# EAGLE design bASEpLATE (EAGLE 8.2.2)
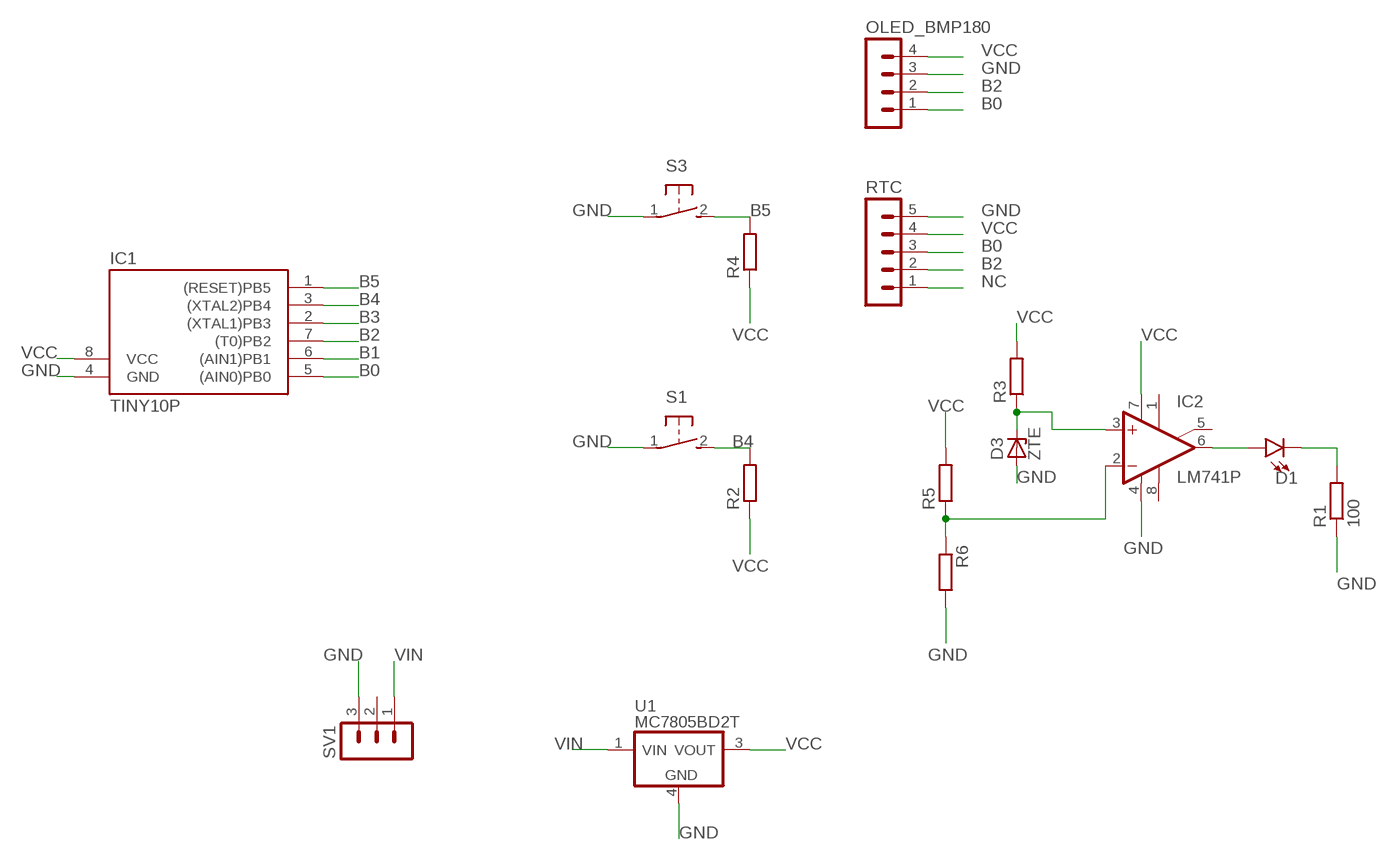
[diagram p0: schematic, sheet 1]

## Parts
D1  LED-3MM-NO_SILK  [LED_3MM-NS]
D3  ZTE  [DO35Z10]
IC1  TINY10P  [DIL08]
IC2  LM741P  [DIL08]
OLED_BMP180  MA04-1  [MA04-1]
R1  100  R-EU_0204/7  [0204/7]
R2  R-EU_0204/7  [0204/7]
R3  R-EU_0204/7  [0204/7]
R4  R-EU_0204/7  [0204/7]
R5  R-EU_0204/7  [0204/7]
R6  R-EU_0204/7  [0204/7]
RTC  MA05-1  [MA05-1]
S1  31-XX  [B3F-31XX]
S3  31-XX  [B3F-31XX]
SV1  MA03-1  [MA03-1]
U1  MC7805BD2T  [D2PAK-3]

## Nets
B0: IC1.5((AIN0)PB0) OLED_BMP180.1 RTC.3
B1: IC1.6((AIN1)PB1)
B2: IC1.7((T0)PB2) OLED_BMP180.2 RTC.2
B3: IC1.2((XTAL1)PB3)
B4: IC1.3((XTAL2)PB4) R2.2 S1.2(S)
B5: IC1.1((RESET)PB5) R4.2 S3.2(S)
GND: D3.A IC1.4(GND) IC2.4(V-) OLED_BMP180.3 R1.1 R6.2 RTC.5 S1.1(P) S3.1(P) SV1.3 U1.4(GND)
N$1: D1.A IC2.6(OUT)
N$2: IC2.2(-IN) R5.1 R6.1
N$3: D3.C IC2.3(+IN) R3.1
N$4: D1.K(C) R1.2
NC: RTC.1
VCC: IC1.8(VCC) IC2.7(V+) OLED_BMP180.4 R2.1 R3.2 R4.1 R5.2 RTC.4 U1.3(VOUT)
VIN: SV1.1 U1.1(VIN)
Unconnected: IC2.1(ON1) IC2.5(ON2) IC2.8(OPT) SV1.2

## Library data of the parts
D1 = SparkFun-LED:LED: LED (Generic) Standard schematic elements and footprints for 5mm, 3mm, 1206, and 0603 sized LEDs. Generic LEDs with no color specified.
D3 = diode:ZTE: Z DIODE 300 mW
IC1 = atmel:TINY10: MICROCONTROLLER 1 Kbytes ROM; OC_FARNELL: unknown; OC_NEWARK: unknown
IC2 = linear:*741: OP AMP
OLED_BMP180 = con-lstb:MA04-1: PIN HEADER; OC_FARNELL: unknown; OC_NEWARK: unknown
R1-R6 = rcl:R-EU_: RESISTOR, European symbol
RTC = con-lstb:MA05-1: PIN HEADER; OC_FARNELL: unknown; OC_NEWARK: unknown
S1 S3 = switch-omron:31-XX: OMRON SWITCH; MPN: B3F-3100; OC_FARNELL: 959704; OC_NEWARK: 36M3582
SV1 = con-lstb:MA03-1: PIN HEADER; OC_FARNELL: unknown; OC_NEWARK: unknown
U1 = _hhn_78xx_79xx_NCV78xx_d2pak_dpak:MC78*: 78xx SMD (D2PAK, DPAK) (MC)78xx..DT (DPAK-3; Rth,JA = 92 K/W) (MC)78xx..D2T (D2PAK-3; Rth,JA = 45 K/W @ 10x10mm copper area) Linear Voltage Regulators, Positive, 1 A (ON Semiconductor) Package dimenisions and soldering footprints acc. to ONSEMI specs. Source: http://onsemi.com Datasheet document#: MC7800/D Technologies: 78xxyD(2)Tz: xx = Output Voltage (V) y, z: additional suffixes see manufacturer's datasheet Author: Dipl.-Ing. FH Rainer Bayer HHN Hochschule Heilbronn, rainer.bayer@hs-heilbronn.de Ingenieurbüro ing-rb, mail@ing-rb.de

## Board
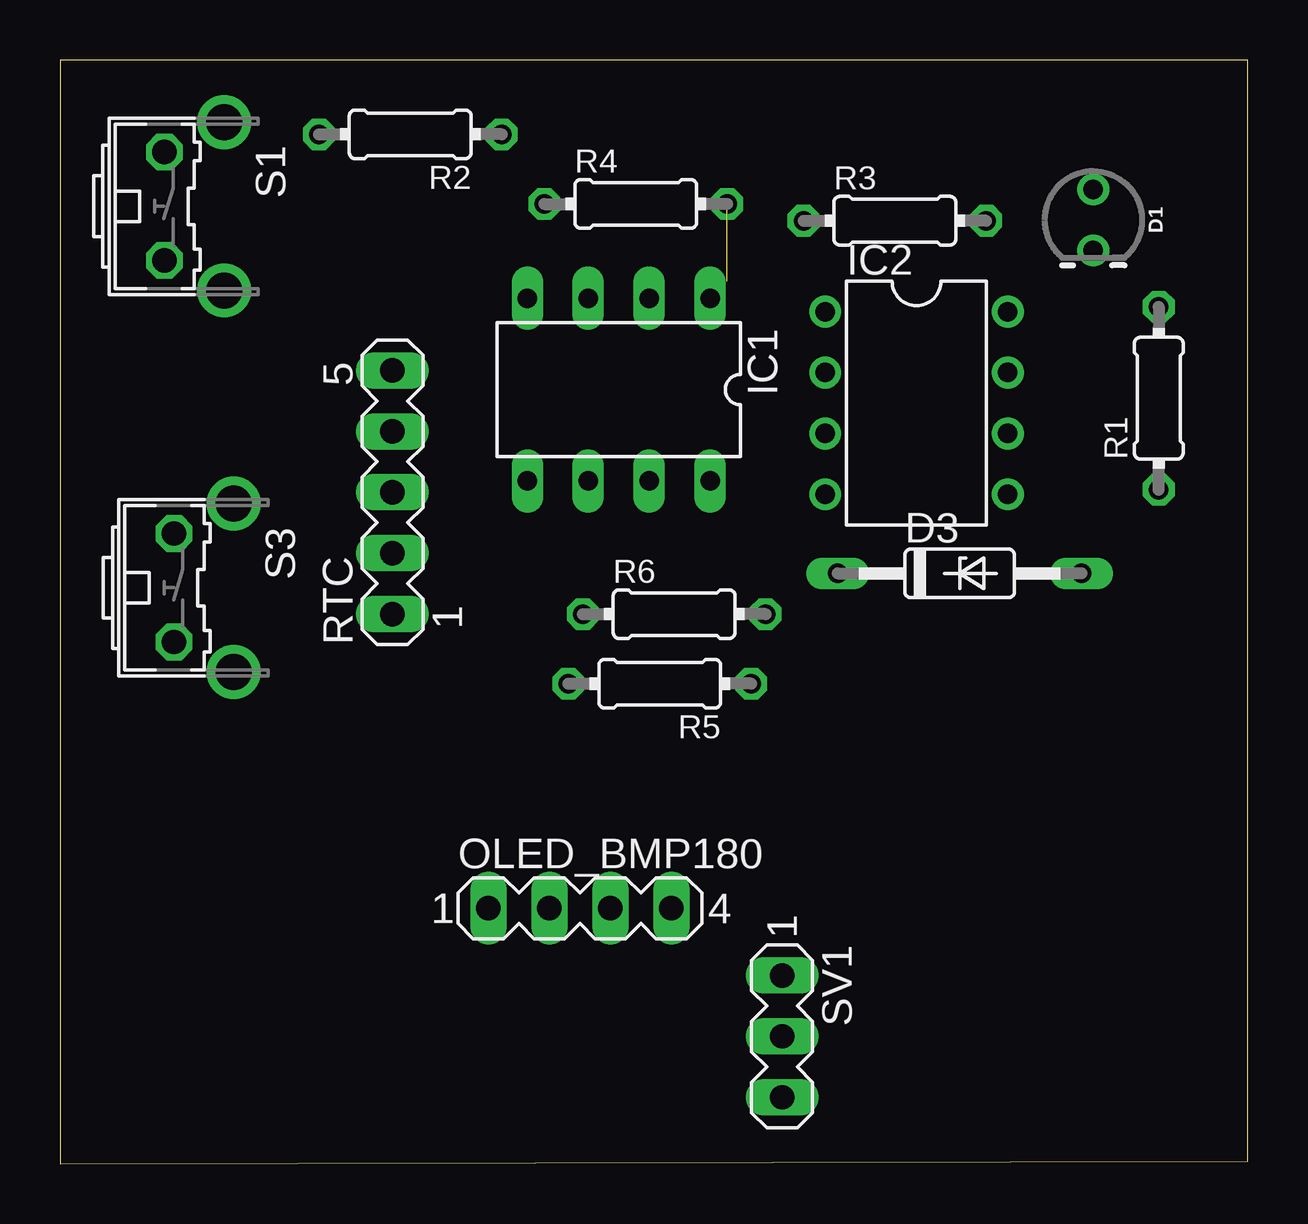
[diagram p1: board, top side]
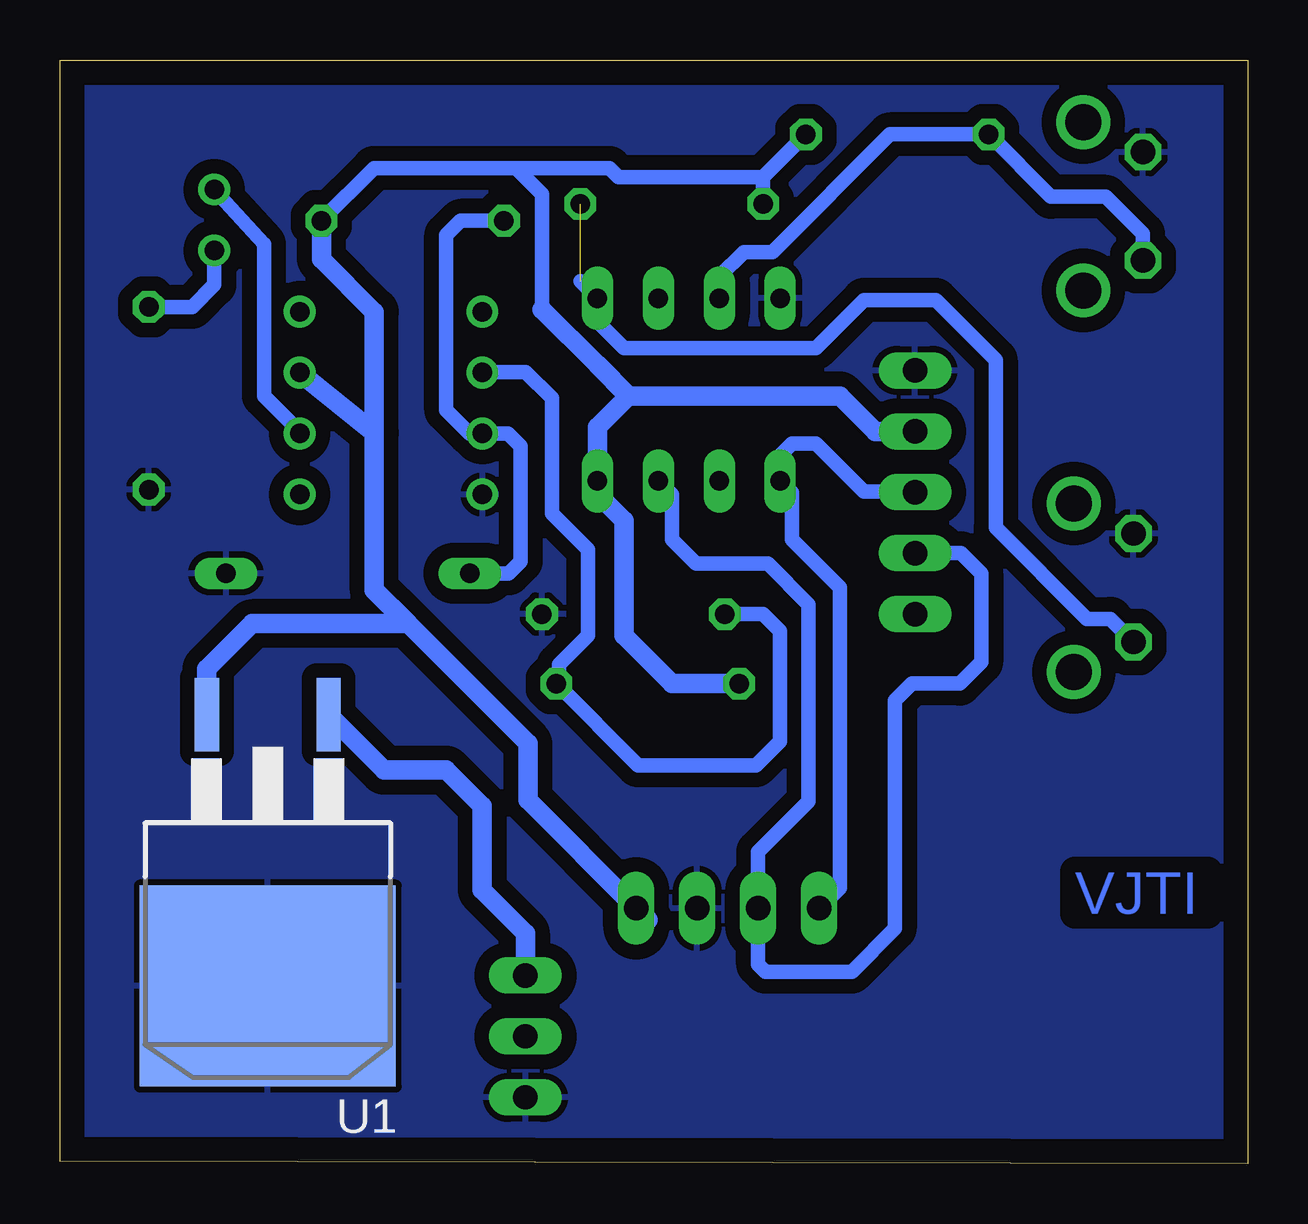
[diagram p2: board, bottom side, seen from below]

Size 49.5 x 46 mm. Coordinates in mm from the lower left corner, seen from the top.
Outline: 0,0 49.5,0.1 49.5,46 0,46 0,0
Copper layers (1*16): Top 0.035mm / dielectric 1.5mm / Bottom 0.035mm
Design rules "default": minimum track width 6mil, minimum drill 0.35mm, track to track 6mil, track to pad 6mil, pad to pad 6mil, via to via 6mil, smd to smd 6mil, copper to edge 40mil, drill to drill 6mil, minimum pad ring 10mil, minimum via ring 8mil, stop-mask expansion 4mil, vias tented up to drill 0mil, thermal gap 10mil

### Footprints (pad centres in the part's own frame; a part is rotated, then mirrored left to right if it is on the bottom)
LED_3MM-NS = drill 0.813: A -1.27,0; K 1.27,0
DO35Z10 = drill 0.813 long: A 5.08,0; C -5.08,0
DIL08 = drill 0.813 long: 1 -3.81,-3.81; 2 -1.27,-3.81; 3 1.27,-3.81; 4 3.81,-3.81; 5 3.81,3.81; 6 1.27,3.81; 7 -1.27,3.81; 8 -3.81,3.81
DIL08' = drill 0.813 pad 1.27: 1 -3.81,-3.81; 2 -1.27,-3.81; 3 1.27,-3.81; 4 3.81,-3.81; 5 3.81,3.81; 6 1.27,3.81; 7 -1.27,3.81; 8 -3.81,3.81
MA04-1 = drill 1.016 long: 1 -3.81,0; 2 -1.27,0; 3 1.27,0; 4 3.81,0
0204/7 = drill 0.813 octagon: 1 -3.81,0; 2 3.81,0
MA05-1 = drill 1.016 long: 1 -5.08,0; 2 -2.54,0; 3 0,0; 4 2.54,0; 5 5.08,0
B3F-31XX = drill 1.016 octagon: 1 -2.261,-1.245; 2 2.261,-1.245 | drill 1.499 pad 2.159: 3 -3.505,1.245; 4 3.505,1.245
MA03-1 = drill 1.016 long: 1 -2.54,0; 2 0,0; 3 2.54,0
D2PAK-3 = smd 1.016 x 3.05: 1 -2.54,-11.31; 3 2.54,-11.31 | smd 10.66 x 8.38: 4 0,0

### Placement (x,y rotation side)
D1  43.07,39.33 270 top
D3  37.5,24.6 0 top
IC1  23.29,32.26 180 top
IC2  LM741P  [DIL08']  35.7,31.7 270 top
OLED_BMP180  21.67,10.64 0 top
R1  45.8,31.9 90 top
R2  14.6,42.9 180 top
R3  34.8,39.3 0 top
R4  24,40 0 top
R5  25,20 180 top
R6  25.6,22.9 0 top
RTC  13.86,27.98 90 top
S1  5.6,39.9 270 top
S3  6,24 270 top
SV1  30.1,5.3 270 top
U1  40.84,7.4 180 bottom

### Tracks (layer width: path | path; a pad name or v marks a point on that pad's centre or on a via)
B0  (via drill 0.35)
  Bottom 0.61: OLED_BMP180.1 17,11.5 17,24 19,26 19,27.97 IC1.5 19.48,29.52 19,30 18,30 16,28 v13.88,28 RTC.3
B2
  Bottom 0.61: IC1.7 24,27.89 24,26 23,25 20,25 18.3,23.3 18.3,15.1 20.4,13 OLED_BMP180.2 20.4,8.3 20.1,8 16.5,8 14.7,9.8 14.7,19.3 14,20 12,20 11.1,20.9 11.1,24.6 11.94,25.44 RTC.2
B4
  Bottom 0.61: IC1.3 22.02,36.98 21,38 19.81,38 14.91,42.9 R2.2 8.19,40.3 5.9,40.3 4.35,38.76 S1.2
B5  (1 unrouted)
  Bottom 0.61: 27.81,36.78 IC1.1 27.1,35.1 26,34 18,34 16,36 13,36 10.5,33.5 10.5,26.5 6.7,22.7 5.72,22.7 S3.2
GND
  pour Bottom (isolate 0.61): 0,45.9 0,0 49.5,0 49.5,46
N$1
  Bottom 0.61: IC2.6 39.73,30.73 41,32 41,38.33 D1.A
N$2
  Bottom 0.61: R6.1 20.2,22.9 19.5,22.2 19.5,17.6 20.5,16.6 25.41,16.6 R5.1 28.7,20.11 28.7,20.8 27.5,22 27.5,25.6 29,27.1 29,31.9 30.1,33 31.26,33 IC2.2
N$3
  Bottom 0.61: R3.1 32.8,39.3 33.4,38.7 33.4,31.4 32.43,30.43 IC2.3 30.83,30.43 30.3,29.9 30.3,25.1 30.8,24.6 D3.C
N$4
  Bottom 0.61: D1.K 43.07,36.63 44,35.7 R1.2
VCC
  Bottom 0.61: 27.57,33.77 27.1,33.3 | 29.4,35.6 29.4,40.4 30.5,41.5 | 30.5,41.5 36.41,41.5 R3.2 | R4.1 20.19,41.12 | 20.19,41.12 R2.1 | 20.19,41.12 26.22,41.12 26.6,41.5 30.5,41.5
  Bottom 0.813: 25,10.16 OLED_BMP180.4 30,15.16 30,17.5 35,22.5 | R5.2 24,20 26,22 26,26.8 27.1,27.9 IC1.8 27.1,30.7 25.8,32 | 36.4,30.46 IC2.7 | 36.4,30.46 36.4,35.5 38.6,37.7 R3.2 | RTC.4 15.52,30.52 17,32 25.8,32 | 29.4,35.6 27.1,33.3 25.8,32 | 35,22.5 41.5,22.5 43.38,20.62 U1.3 | 35,22.5 36.4,23.9 36.4,30.46
VIN
  Bottom 0.813: U1.1 35.99,16.4 33.4,16.4 31.9,14.9 31.9,11.4 30.1,9.6 SV1.1

### Text on the board
Bottom: VJTI